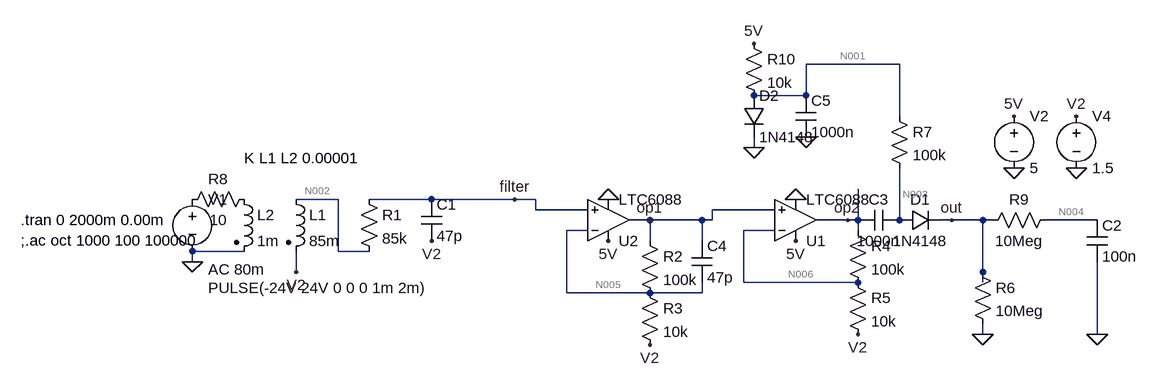
[diagram p0: schematic pw_original.asc]
pw_original.asc, the LTspice schematic file:
Version 4
SHEET 1 3076 680
WIRE 944 -176 800 -176
WIRE 800 -128 800 -176
WIRE 800 -128 720 -128
WIRE 944 -96 944 -176
WIRE 720 -48 720 -64
WIRE 80 32 16 32
WIRE 224 32 128 32
WIRE 352 32 224 32
WIRE 384 32 352 32
WIRE 384 48 384 32
WIRE 464 48 384 48
WIRE 752 48 656 48
WIRE 560 64 528 64
WIRE 640 64 560 64
WIRE 656 64 656 48
WIRE 656 64 640 64
WIRE 864 64 816 64
WIRE 880 64 880 16
WIRE 880 64 864 64
WIRE 944 64 944 -16
WIRE 1024 64 1008 64
WIRE 1072 64 1024 64
WIRE 1088 64 1072 64
WIRE 1248 64 1168 64
WIRE 464 80 432 80
WIRE 752 80 704 80
WIRE 880 80 880 64
WIRE 560 96 560 64
WIRE 640 96 640 64
WIRE -64 112 -144 112
WIRE 80 112 80 32
WIRE 128 112 80 112
WIRE -144 128 -144 112
WIRE 16 144 16 112
WIRE 1072 144 1072 64
WIRE 704 160 704 80
WIRE 880 160 704 160
WIRE 1072 160 1072 144
WIRE 432 176 432 80
WIRE 560 176 432 176
WIRE 640 176 640 160
WIRE 640 176 560 176
WIRE 1072 240 1072 224
WIRE 1248 240 1248 128
FLAG 352 32 filter
FLAG 560 64 op1
FLAG 496 32 0
FLAG 496 96 5V
FLAG 1120 -16 0
FLAG 1120 -96 5V
FLAG 1216 -16 0
FLAG 1216 -96 V2
FLAG 16 144 V2
FLAG 224 96 V2
FLAG 560 256 V2
FLAG 784 32 0
FLAG 784 96 5V
FLAG 880 240 V2
FLAG 864 64 op2
FLAG 1248 240 0
FLAG 1072 240 0
FLAG 1024 64 out
FLAG 800 -64 0
FLAG -144 128 0
FLAG 720 -48 0
FLAG 720 -208 5V
SYMBOL ind2 0 16 R0
SYMATTR InstName L1
SYMATTR Value 85m
SYMATTR Type ind
SYMBOL res 112 16 R0
SYMATTR InstName R1
SYMATTR Value 85k
SYMBOL cap 208 32 R0
SYMATTR InstName C1
SYMATTR Value 47p
SYMBOL voltage -144 16 R0
WINDOW 123 24 124 Left 2
WINDOW 39 0 0 Left 0
WINDOW 3 24 152 Left 2
SYMATTR Value2 AC 80m
SYMATTR InstName V1
SYMATTR Value PULSE(-24V 24V 0 0 0 1m 2m)
SYMBOL res 544 80 R0
SYMATTR InstName R2
SYMATTR Value 100k
SYMBOL res 544 160 R0
SYMATTR InstName R3
SYMATTR Value 10k
SYMBOL Opamps\\LTC6088 496 64 M180
SYMATTR InstName U2
SYMBOL voltage 1120 -112 R0
WINDOW 123 0 0 Left 0
WINDOW 39 0 0 Left 0
SYMATTR InstName V2
SYMATTR Value 5
SYMBOL voltage 1216 -112 R0
WINDOW 123 0 0 Left 0
WINDOW 39 0 0 Left 0
SYMATTR InstName V4
SYMATTR Value 1.5
SYMBOL Opamps\\LTC6088 784 64 M180
SYMATTR InstName U1
SYMBOL res 864 64 R0
SYMATTR InstName R4
SYMATTR Value 100k
SYMBOL res 864 144 R0
SYMATTR InstName R5
SYMATTR Value 10k
SYMBOL diode 944 80 R270
WINDOW 0 32 32 VTop 2
WINDOW 3 0 32 VBottom 2
SYMATTR InstName D1
SYMATTR Value 1N4148
SYMBOL cap 1232 64 R0
SYMATTR InstName C2
SYMATTR Value 100n
SYMBOL res 1056 128 R0
SYMATTR InstName R6
SYMATTR Value 10Meg
SYMBOL cap 944 48 R90
WINDOW 0 0 32 VBottom 2
WINDOW 3 32 32 VTop 2
SYMATTR InstName C3
SYMATTR Value 1000n
SYMBOL res 928 -112 R0
SYMATTR InstName R7
SYMATTR Value 100k
SYMBOL cap 624 96 R0
SYMATTR InstName C4
SYMATTR Value 47p
SYMBOL ind2 -80 16 R0
SYMATTR InstName L2
SYMATTR Value 1m
SYMATTR Type ind
SYMBOL res -48 16 R90
WINDOW 0 0 56 VBottom 2
WINDOW 3 32 56 VTop 2
SYMATTR InstName R8
SYMATTR Value 10
SYMBOL res 1184 48 R90
WINDOW 0 0 56 VBottom 2
WINDOW 3 32 56 VTop 2
SYMATTR InstName R9
SYMATTR Value 10Meg
SYMBOL diode 704 -128 R0
SYMATTR InstName D2
SYMATTR Value 1N4148
SYMBOL res 704 -224 R0
SYMATTR InstName R10
SYMATTR Value 10k
SYMBOL cap 784 -128 R0
SYMATTR InstName C5
SYMATTR Value 1000n
TEXT -408 64 Left 2 !.tran 0 2000m 0.00m\n;.ac oct 1000 100 100000
TEXT -64 -32 Left 2 !K L1 L2 0.00001

The netlist it stands for:
* pw_original.asc
L1 N002 V2 85m
R1 filter N002 85k
C1 filter V2 47p
V1 P001 0 PULSE(-24V 24V 0 0 0 1m 2m) AC 80m
R2 op1 N005 100k
R3 N005 V2 10k
* U2: LTC6088 (symbol Opamps\LTC6088 not available, pins judged from their places): In+=filter In-=N005 V+=5V V-=0 OUT=op1
V2 5V 0 5
V4 V2 0 1.5
* U1: LTC6088 (symbol Opamps\LTC6088 not available, pins judged from their places): In+=op1 In-=N006 V+=5V V-=0 OUT=op2
R4 op2 N006 100k
R5 N006 V2 10k
D1 N003 out 1N4148
C2 N004 0 100n
R6 out 0 10Meg
C3 N003 op2 1000n
R7 N001 N003 100k
C4 op1 N005 47p
L2 P002 0 1m
R8 P002 P001 10
R9 N004 out 10Meg
D2 N001 0 1N4148
R10 5V N001 10k
C5 N001 0 1000n
.model D D
.lib standard.dio
.tran 0 2000m 0.00m
;.ac oct 1000 100 100000
K L1 L2 0.00001
.backanno
.end

* Results of the author's LTspice run, read from the files saved beside the schematic
* Operating Point, zero values left out:
*   V(n002) = 1.5 V
*   V(v2) = 1.5 V
*   V(filter) = 1.5 V
*   V(p001) = -24 V
*   V(op1) = 1.5 V
*   V(n005) = 1.5 V
*   V(5v) = 5 V
*   V(op2) = 1.5 V
*   V(n006) = 1.5 V
*   V(n003) = 543.6 mV
*   V(out) = 414.1 mV
*   V(n004) = 414.1 mV
*   V(n001) = 547.8 mV
*   I(D2) = 445.2 µA
*   I(D1) = 41.41 nA
*   I(L2) = -2.4 A
*   I(R10) = 445.2 µA
*   I(R8) = 2.4 A
*   I(R7) = 41.41 nA
*   I(R6) = 41.41 nA
*   I(R5) = 555.9 pA
*   I(R4) = 555.8 pA
*   I(R3) = 46.48 pA
*   I(R2) = 46.38 pA
*   I(V4) = 602.4 pA
*   I(V2) = -2.543 mA
*   I(V1) = 2.4 A
*   Ix(u2:3) = 1.049 mA
*   Ix(u2:4) = -1.049 mA
*   Ix(u2:5) = -44.28 pA
*   Ix(u1:3) = 1.049 mA
*   Ix(u1:4) = -1.049 mA
*   Ix(u1:5) = -553.8 pA